# EAGLE schematic acq07 (EAGLE 9.6.2)
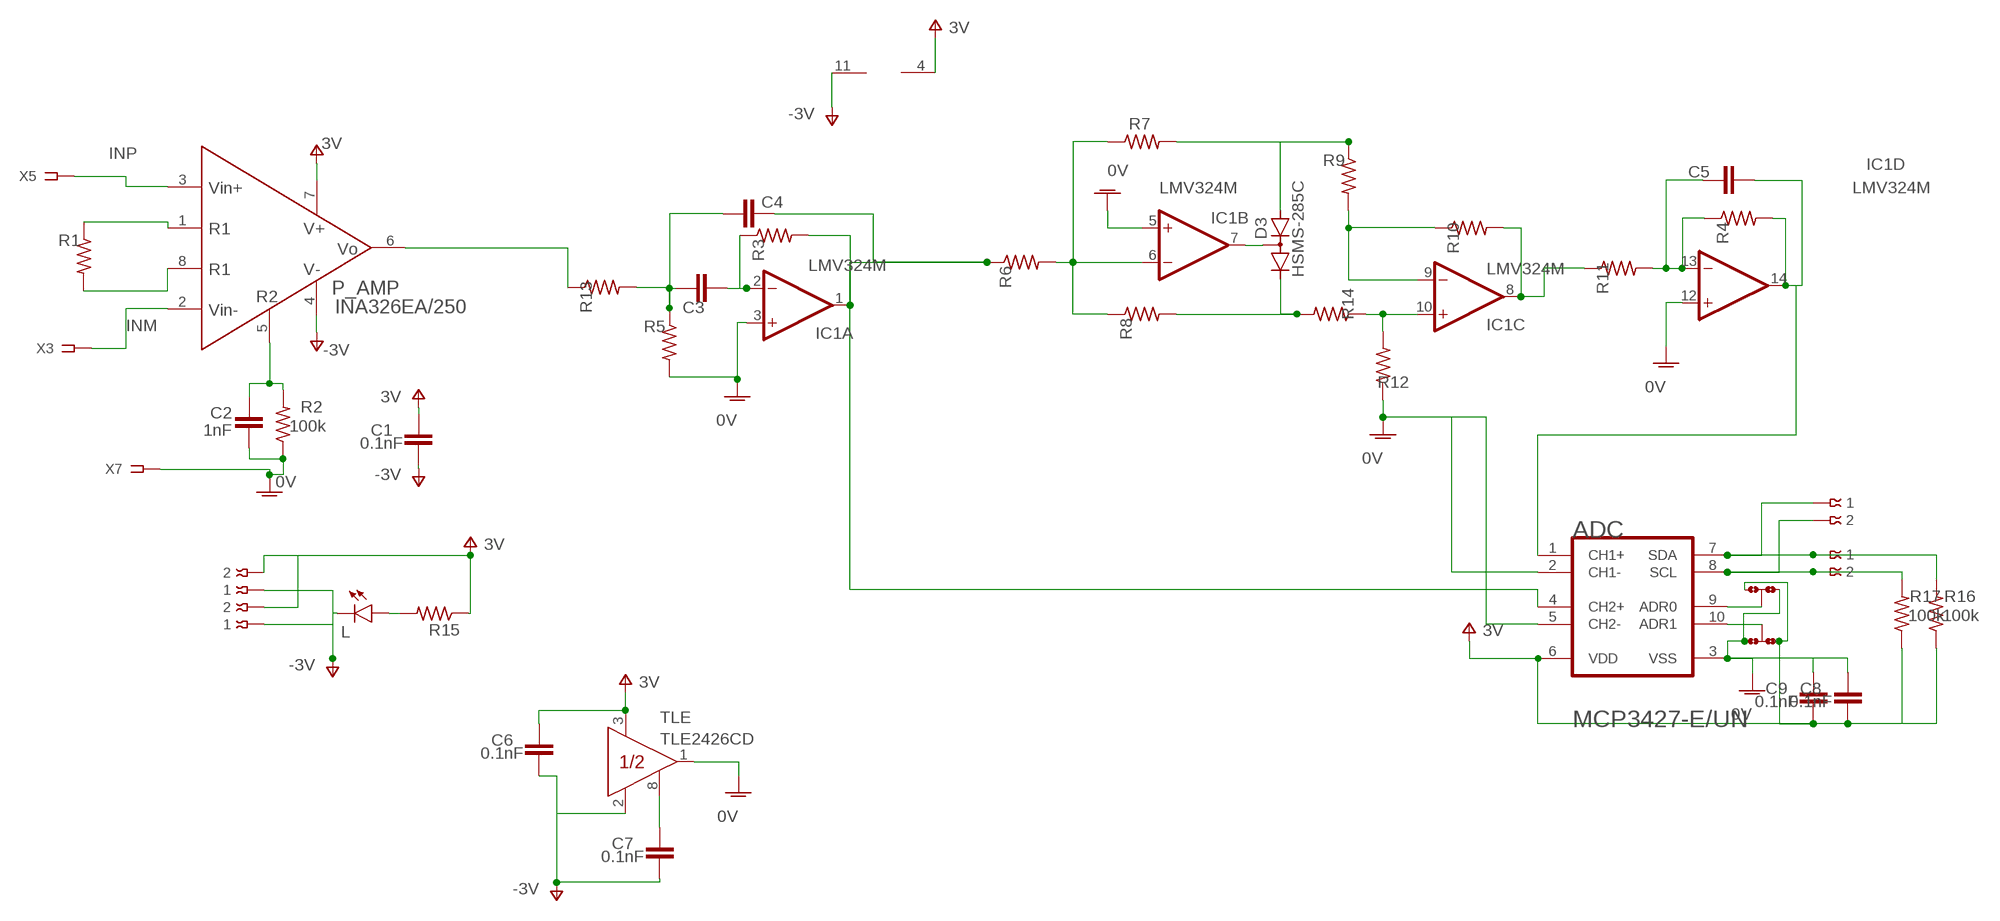
[diagram p0: schematic, sheet 1]

## Parts
A1  0R-JUMPC  [C0R-JMP]
A2  0R-JUMPC  [C0R-JMP]
ADC  MICROCHIP_MCP3427-E-UNMICROCHIP_MCP3427-E-UN_0_0  [MICROCHIP_MCP3427-E-UN_0]
C1  0.1nF  C-EUC0201  [C0201]
C2  1nF  C-EUC0201  [C0201]
C3  0.1nF  C-EUC0201  [C0201]
C4  0.1nF  C-EUC0201  [C0201]
C5  0.1nF  C-EUC0201  [C0201]
C6  0.1nF  C-EUC0201  [C0201]
C7  0.1nF  C-EUC0201  [C0201]
C8  0.1nF  C-EUC0201  [C0201]
C9  0.1nF  C-EUC0201  [C0201]
D3  HSMS-285C  [SOT323]
IC1  LMV324M  [SO14]
L  LEDCHIP-LED0603  [CHIP-LED0603]
P_AMP  INA326EA/250  [SOP65P490X110-8N]
R1  100k  R-US_R0201  [R0201]
R2  100k  R-US_R0201  [R0201]
R3  100k  R-US_R0201  [R0201]
R4  100k  R-US_R0201  [R0201]
R5  100k  R-US_R0201  [R0201]
R6  100k  R-US_R0201  [R0201]
R7  100k  R-US_R0201  [R0201]
R8  100k  R-US_R0201  [R0201]
R9  100k  R-US_R0201  [R0201]
R10  100k  R-US_R0201  [R0201]
R11  100k  R-US_R0201  [R0201]
R12  100k  R-US_R0201  [R0201]
R13  100k  R-US_R0201  [R0201]
R14  100k  R-US_R0201  [R0201]
R15  R-US_R0201  [R0201]
R16  100k  R-US_R0201  [R0201]
R17  100k  R-US_R0201  [R0201]
TLE  TLE2426CD  [SO-8]
X1  009176002  [009176002]
X2  009176002  [009176002]
X3  SSW-101-02-G-S  [SSW-101-02-G-S]
X4  009176002  [009176002]
X5  SSW-101-02-G-S  [SSW-101-02-G-S]
X6  009176002  [009176002]
X7  SSW-101-02-G-S  [SSW-101-02-G-S]

## Nets
GNDA: A1.1 A2.1 ADC.2(CH1-) ADC.3(VSS) ADC.5(CH2-) C2.1 C8.1 C9.1 IC1.3(A:+IN) IC1.5(B:+IN) IC1.12(D:+IN) R2.1 R5.2 R12.1 TLE.1(OUT) X7.1 ; supply symbol labelled 0V
INM: P_AMP.2(VIN-) X3.1
INP: P_AMP.3(VIN+) X5.1
N$1: P_AMP.1(R1_2) R1.1
N$2: P_AMP.8(R1) R1.2
N$4: C2.2 P_AMP.5(R2) R2.2
N$6: C3.1 IC1.2(A:-IN) R3.1
N$7: C3.2 C4.2 R5.1 R13.2
N$8: C5.1 IC1.13(D:-IN) R4.1 R11.2
N$9: P_AMP.6(VO) R13.1
N$10: IC1.6(B:-IN) R6.2 R7.1 R8.1
N$11: D3.2(C) R8.2 R14.2
N$12: IC1.9(C:-IN) R9.2 R10.1
N$13: D3.3(AC) IC1.7(B:OUT)
N$14: D3.1(A) R7.2 R9.1
N$15: IC1.8(C:OUT) R10.2 R11.1
N$16: ADC.1(CH1+) C5.2 IC1.14(D:OUT) R4.2
N$17: ADC.7(SDA) R16.2 X2.1 X6.1
N$18: IC1.10(C:+IN) R12.2 R14.1
N$23: ADC.4(CH2+) C4.1 IC1.1(A:OUT) R3.2 R6.1
N$54: L.A R15.2
N$55: C7.1 TLE.8(NR)
N$56: ADC.8(SCL) R17.2 X2.2 X6.2
N$57: A1.2 ADC.9(ADR0)
N$58: A2.2 ADC.10(ADR1)
V+: A1.3 A2.3 ADC.6(VDD) C1.1 C6.1 C8.2 C9.2 IC1.4(P:V+) P_AMP.7(V+) R15.1 R16.1 R17.1 TLE.3(IN) X1.2 X4.2 ; supply symbol labelled 3V
V-: C1.2 C6.2 C7.2 IC1.11(P:V-) L.C P_AMP.4(V-) TLE.2(COM) X1.1 X4.1 ; supply symbol labelled -3V

## Library data of the parts
A1 A2 = jump-0r-smd:0R-JUMP: SMD 0R 0805 Jumper
ADC = UN:MICROCHIP_MCP3427-E-UN: CON-ADC-MCP3427-10; CIIVA_IDS: 1029210; COMPONENT_LINK_1_DESCRIPTION: Manufacturer URL; COMPONENT_LINK_1_URL: http://www.microchip.com/; COMPONENT_LINK_3_DESCRIPTION: Package Specification; COMPONENT_LINK_3_URL: http://www.microchip.com/stellent/groups/techpub_sg/documents/packagingspec/en012702.pdf; DATASHEET: http://ww1.microchip.com/downloads/en/DeviceDoc/22226a.pdf; DATASHEET_VERSION: revA, Dec-2009; FOOTPRINT_VARIANT_NAME_0: Level C; FOOTPRINT_VARIANT_NAME_1: Level B; FOOTPRINT_VARIANT_NAME_2: Level A; IMPORTED: yes; IMPORTED_FROM: vault; IMPORT_TS: 1521848675; MF: Microchip; MPN: MCP3427-E/UN; PACKAGE: MSOP-UN10; PACKAGE_DESCRIPTION: 10-Lead Plastic Micro Small Outline Package (UN) [MSOP]; PACKAGE_VERSION: revBB, Aug-2009; PIN_0_0_2_INSIDE_EDGE: clock; PREFIX: U; RELEASE_DATE: 1331949051; VAULT_GUID: A68823D5-815D-456C-A47E-4251F2B2754A; VAULT_REVISION: E4767321-FC88-4F77-9C9C-64A9666F4DA4
C1-C9 = rcl:C-EU: CAPACITOR, European symbol; SPICEPREFIX: C
D3 = avago:HSMS-285C: Surface Mount Microwave Schottky Detector Diodes Source: Data sheet <http://www.farnell.com/datasheets/461166.pdf>
IC1 = linear:LMV324?*: Quad General Purpose, Low Voltage, Rail-to-Rail Output Operational Amplifiers Source: http://www.national.com/mpf/LM/LMV321.html http://www.national.com/dt/lmv_qual.pdf; SPICEPREFIX: J
L = led:LED: LED OSRAM: - CHIPLED LG R971, LG N971, LY N971, LG Q971, LY Q971, LO R971, LY R971 LH N974, LH R974 LS Q976, LO Q976, LY Q976 LO Q996 - Hyper CHIPLED LW Q18S LB Q993, LB Q99A, LB R99A - SideLED LS A670, LO A670, LY A670, LG A670, LP A670 LB A673, LV A673, LT A673, LW A673 LH A674 LY A675 LS A676, LA A676, LO A676, LY A676, LW A676 LS A679, LY A679, LG A679 - Hyper Micro SIDELED® LS Y876, LA Y876, LO Y876, LY Y876 LT Y87S - SmartLED LW L88C, LW L88S LB L89C, LB L89S, LG L890 LS L89K, LO L89K, LY L89K LS L896, LA L896, LO L896, LY L896 - TOPLED LS T670, LO T670, LY T670, LG T670, LP T670 LSG T670, LSP T670, LSY T670, LOP T670, LYG T670 LG T671, LOG T671, LSG T671 LB T673, LV T673, LT T673, LW T673 LH T674 LS T676, LA T676, LO T676, LY T676, LB T676, LH T676, LSB T676, LW T676 LB T67C, LV T67C, LT T67C, LS T67K, LO T67K, LY T67K, LW E67C LS E67B, LA E67B, LO E67B, LY E67B, LB E67C, LV E67C, LT E67C LW T67C LS T679, LY T679, LG T679 LS T770, LO T770, LY T770, LG T770, LP T770 LB T773, LV T773, LT T773, LW T773 LH T774 LS E675, LA E675, LY E675, LS T675 LS T776, LA T776, LO T776, LY T776, LB T776 LHGB T686 LT T68C, LB T68C - Hyper Mini TOPLED® LB M676 - Mini TOPLED Santana® LG M470 LS M47K, LO M47K, LY M47K Source: http://www.osram.convergy.de LUXEON: - LUMILED® LXK2-PW12-R00, LXK2-PW12-S00, LXK2-PW14-U00, LXK2-PW14-V00 LXK2-PM12-R00, LXK2-PM12-S00, LXK2-PM14-U00 LXK2-PE12-Q00, LXK2-PE12-R00, LXK2-PE12-S00, LXK2-PE14-T00, LXK2-PE14-U00 LXK2-PB12-K00, LXK2-PB12-L00, LXK2-PB12-M00, LXK2-PB14-N00, LXK2-PB14-P00, LXK2-PB14-Q00 LXK2-PR12-L00, LXK2-PR12-M00, LXK2-PR14-Q00, LXK2-PR14-R00 LXK2-PD12-Q00, LXK2-PD12-R00, LXK2-PD12-S00 LXK2-PH12-R00, LXK2-PH12-S00 LXK2-PL12-P00, LXK2-PL12-Q00, LXK2-PL12-R00 Source: www.luxeon.com KINGBRIGHT: KA-3528ASYC Source: www.kingbright.com
P_AMP = INA326EA_250:INA326EA/250: Precision, Rail-to-Rail I/O INSTRUMENTATION AMPLIFIER; DESCRIPTION: Precision, Low Drift, CMOS Instrumentation Amplifier 8-VSSOP -40 to 85; DIGI-KEY_PART_NUMBER: 296-15312-1-ND; DIGI-KEY_PURCHASE_URL: https://www.digikey.com/product-detail/en/texas-instruments/INA326EA-250/296-15312-1-ND/568254?utm_source=snapeda&utm_medium=aggregator&utm_campaign=symbol; MF: Texas Instruments; MP: INA326EA/250; PACKAGE: MSOP-8 Texas Instruments
R1-R17 = rcl:R-US_: RESISTOR, American symbol; SPICEPREFIX: R
TLE = tle2426:TLE2426*: Texas Instruments "rail splitter" with noise-reduction
X1 X2 X4 X6 = con-avxPerso:00917?002: Wire to Board Strip IDC Connector 2 WAY Source: http://www.avx.com/docs/Catalogs/9176.pdf http://www.avx.com/docs/Catalogs/9177.pdf; MPN: 009176002001006; OC_FARNELL: 1582834; OC_NEWARK: 66M1960
X3 X5 X7 = con-samtec:SSW-101-02-G-S: THROUGH-HOLE .025" SQ POST SOCKET Source: Samtec SSW.pdf; MF: Samtec Inc.; MPN: SSW-101-02-G-S; OC_FARNELL: unknown; OC_NEWARK: 11P9336